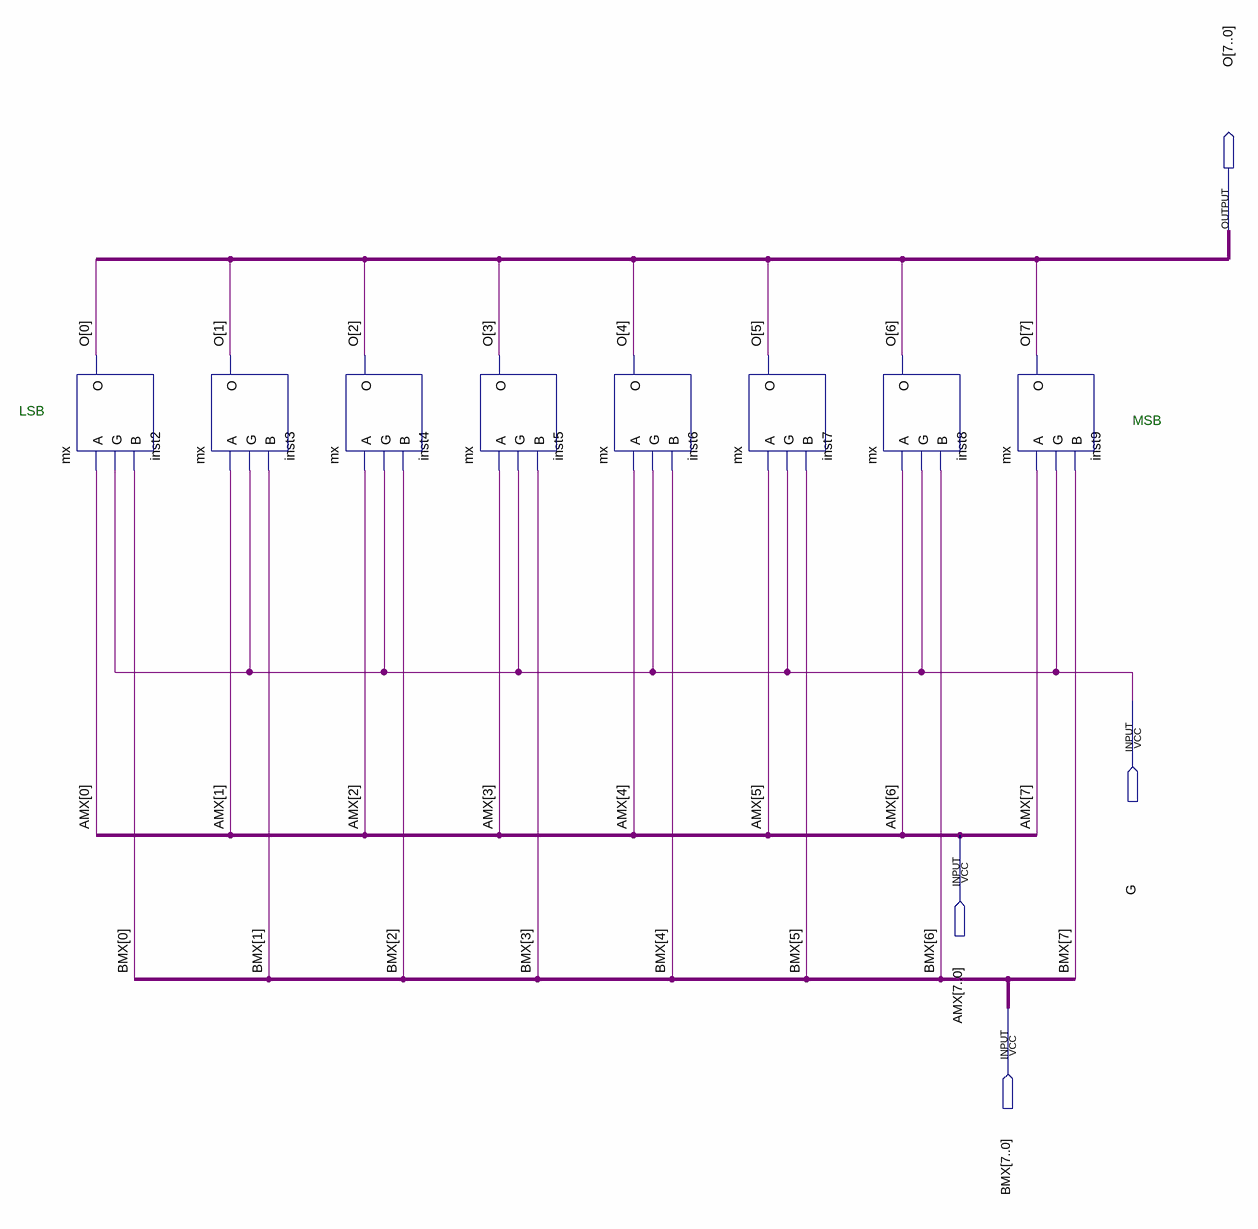
[diagram p0: schematic sheet]
// Quartus schematic 8bitmux.bdf as structural Verilog: 8 symbols, 4 pins
module \8bitmux  (
  input  G,
  input  [7:0] AMX,
  input  [7:0] BMX,
  output [7:0] O
);

  mx inst2 (.A(AMX[0]), .G(G), .B(BMX[0]), .O(O[0]));
  mx inst3 (.A(AMX[1]), .G(G), .B(BMX[1]), .O(O[1]));
  mx inst4 (.A(AMX[2]), .G(G), .B(BMX[2]), .O(O[2]));
  mx inst5 (.A(AMX[3]), .G(G), .B(BMX[3]), .O(O[3]));
  mx inst6 (.A(AMX[4]), .G(G), .B(BMX[4]), .O(O[4]));
  mx inst7 (.A(AMX[5]), .G(G), .B(BMX[5]), .O(O[5]));
  mx inst8 (.A(AMX[6]), .G(G), .B(BMX[6]), .O(O[6]));
  mx inst9 (.A(AMX[7]), .G(G), .B(BMX[7]), .O(O[7]));

  // Notes on the sheet:
  //   LSB
  //   MSB
endmodule
